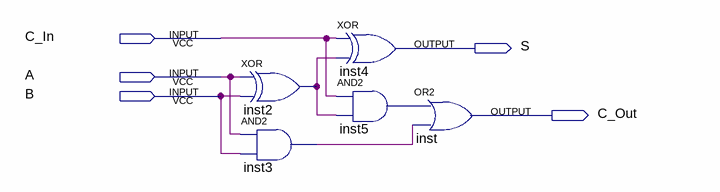
[diagram p0: schematic sheet]
// Quartus schematic SUM1.bdf as structural Verilog: 5 symbols, 5 pins
module SUM1 (
  input  C_In,
  input  A,
  input  B,
  output S,
  output C_Out
);

  wire inst2_out, inst3_out, inst5_out;

  xor inst2 (inst2_out, A, B);
  and inst3 (inst3_out, A, B);
  xor inst4 (S, C_In, inst2_out);
  and inst5 (inst5_out, C_In, inst2_out);
  or inst (C_Out, inst5_out, inst3_out);
endmodule
